# Altium schematic sheet EEG_Power_Connector.SchDoc
size A4
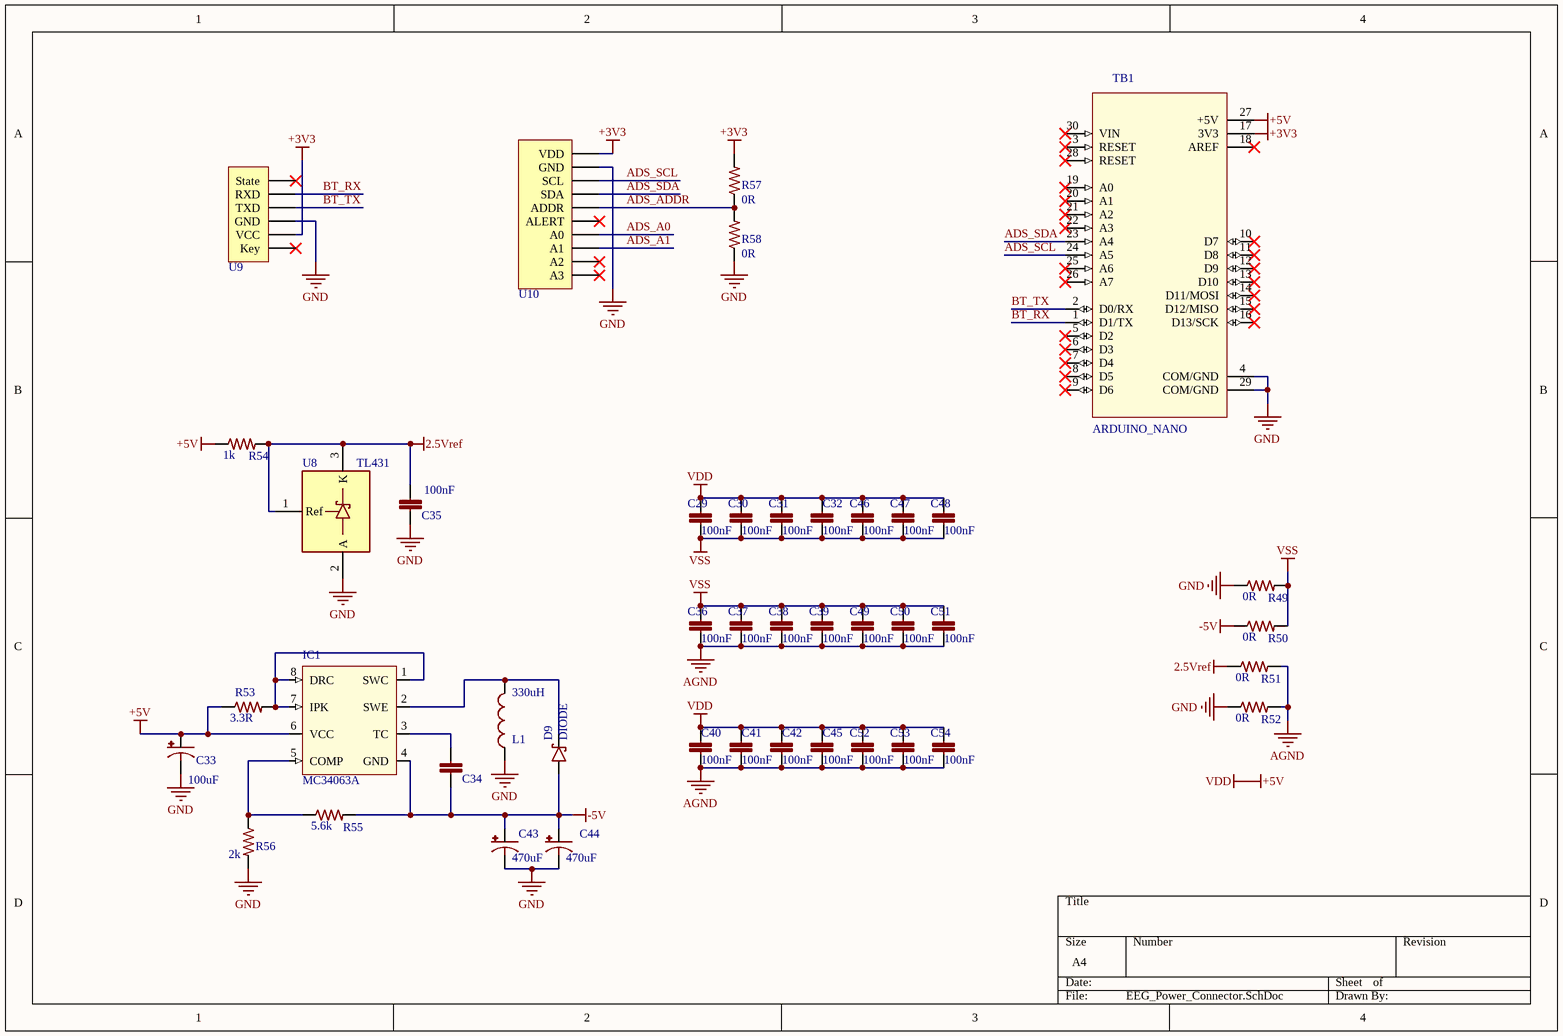
[diagram p0: EEG_Power_Connector.SchDoc]

## Parts
C29  100nF  [C0805 - rounded]
C30  100nF  [C0805 - rounded]
C31  100nF  [C0805 - rounded]
C32  100nF  [C0805 - rounded]
C33  100uF  [E1,8-4]
C34  (no value)  [C0805 - rounded]
C35  100nF  [C0805 - rounded]
C36  100nF  [C0805 - rounded]
C37  100nF  [C0805 - rounded]
C38  100nF  [C0805 - rounded]
C39  100nF  [C0805 - rounded]
C40  100nF  [C0805 - rounded]
C41  100nF  [C0805 - rounded]
C42  100nF  [C0805 - rounded]
C43  470uF  [E1,8-4]
C44  470uF  [E1,8-4]
C45  100nF  [C0805 - rounded]
C46  100nF  [C0805 - rounded]
C47  100nF  [C0805 - rounded]
C48  100nF  [C0805 - rounded]
C49  100nF  [C0805 - rounded]
C50  100nF  [C0805 - rounded]
C51  100nF  [C0805 - rounded]
C52  100nF  [C0805 - rounded]
C53  100nF  [C0805 - rounded]
C54  100nF  [C0805 - rounded]
D9  DIODE  [DO214AA]
IC1  MC34063A  [DIP8]
L1  330uH  [L-PTH-12x9.5]
R49  0R  [R0805 - rounded]
R50  0R  [R0805 - rounded]
R51  0R  [R0805 - rounded]
R52  0R  [R0805 - rounded]
R53  3.3R  [R0805 - rounded]
R54  1k  [R0805 - rounded]
R55  5.6k  [R0805 - rounded]
R56  2k  [R0805 - rounded]
R57  0R  [R0805 - rounded]
R58  0R  [R0805 - rounded]
TB1  ARDUINO_NANO  [ARDUINO_NANO_SHIELD]
U8  (no value)  [TO92 - TL431]
U9  HC-05/6  [HC-05/6 - upside down]  (value not drawn)
U10  ADS1115 module  [ADS1115 Module - horizontal]  (value not drawn)

## Nets
2.5Vref: C35.2 R51.1 R54.2 U8.1(Ref) U8.3(K)
+3V3: R57.2 TB1.17(3V3) U9.5(VCC) U10.1(VDD)
+5V: C29.2 C30.2 C31.2 C32.2 C33.+ C40.2 C41.2 C42.2 C45.2 C46.2 C47.2 C48.2 C52.2 C53.2 C54.2 IC1.6(VCC) R53.1 R54.1 TB1.27(+5V)  [also labelled VDD]
-5V: C34.1 C43.+ C44.+ D9.A IC1.4(GND) R50.1 R55.2
AGND: C36.2 C37.1 C38.1 C39.1 C40.1 C41.1 C42.1 C45.1 C49.1 C50.1 C51.1 C52.1 C53.1 C54.1 R51.2 R52.2
GND: C33.- C35.1 C43.- C44.- L1.1 R49.1 R52.1 R56.2 R58.1 TB1.4(COM/GND) TB1.29(COM/GND) U8.2(A) U9.4(GND) U10.2(GND)
VSS: C29.1 C30.1 C31.1 C32.1 C36.1 C37.2 C38.2 C39.2 C46.1 C47.1 C48.1 C49.2 C50.2 C51.2 R49.2 R50.2
ADS_A0: U10.7(A0)
ADS_A1: U10.8(A1)
ADS_ADDR: R57.1 R58.2 U10.5(ADDR)
ADS_SCL: TB1.24(A5) U10.3(SCL)
ADS_SDA: TB1.23(A4) U10.4(SDA)
BT_RX: TB1.1(D1/TX) U9.2(RXD)
BT_TX: TB1.2(D0/RX) U9.3(TXD)
NetC34_2: C34.2 IC1.3(TC)
NetD9_C: D9.C IC1.2(SWE) L1.2
NetIC1_1: IC1.1(SWC) IC1.7(IPK) IC1.8(DRC) R53.2
NetIC1_5: IC1.5(COMP) R55.1 R56.1

Not connected (* = marked no-connect by the designer): TB1 3(RESET)* 5(D2)* 6(D3)* 7(D4)* 8(D5)* 9(D6)* 10(D7)* 11(D8)* 12(D9)* 13(D10)* 14(D11/MOSI)* 15(D12/MISO)* 16(D13/SCK)* 18(AREF)* 19(A0)* 20(A1)* 21(A2)* 22(A3)* 25(A6)* 26(A7)* 28(RESET)* 30(VIN)*; U9 1(State)* 6(Key)*; U10 6(ALERT)* 9(A2)* 10(A3)*

## Library data of the parts
C29-C32 C34-C42 C45-C54 = C-EU-SMD: Generic Capacitor SMD
  C29-C32 C35-C42 C45-C54: Value: 100nF
C33 C43 C44 = CPOL-US-PTH: Genereric Polarized Capacitor PTH
  C33: Value: 100uF
  C43 C44: Value: 470uF
D9 = SCHOTTKY-DIODE
IC1 = MC34063A: 1.5-A Boost/Buck/Inverting Switching Regulator; MF: Texas Instruments; Price: None; SnapEDA_Link: https://www.snapeda.com/parts/MC34063A/Texas%20Instruments/view-part/?ref=snap; Availability: Unavailable; MP: MC34063A; Package: SOIC-8 Texas Instruments; Value: *
L1 = L-US-PTH: Value: 330uH
R49-R58 = R-US-SMD: Generic Resistor SMD
  R49-R52 R57 R58: Value: 0R
  R53: Value: 3.3R
  R54: Value: 1k
  R55: Value: 5.6k
  R56: Value: 2k
TB1 = ARDUINO_NANO: Dev.kit: Arduino; UART; ICSP, USB B mini, pin strips; MP: ARDUINO NANO; Package: None; Availability: Unavailable; Price: None; SnapEDA_Link: https://www.snapeda.com/parts/ARDUINO%20NANO/Arduino/view-part/?ref=snap; MF: Arduino; Value: *
U8 = TL431: Voltage References Rail Virtual Ground; Part Number: TL431
U9 = HC-05/6: Bluetooth to Serial Port Module; Part Number: HC-05/6
U10 = ADS1115 module: 16Bit I2C ADC+PGA; Vendor: Adafruit; Part Number: ADS1115 module